# Altium schematic sheet EDU_High-Speed-Design_CPU_DDR3.SchDoc: CPU DDR3
size 431 x 279 mm; Date: not used; ApprovedBy: not used; CheckedBy: not used; Author: not used; DrawnBy: not used; Organization: not used; Address4: not used; SheetNumber: 13; SheetTotal: 26; Time: not used; ImagePath: not used; Application_BuildNumber: not used
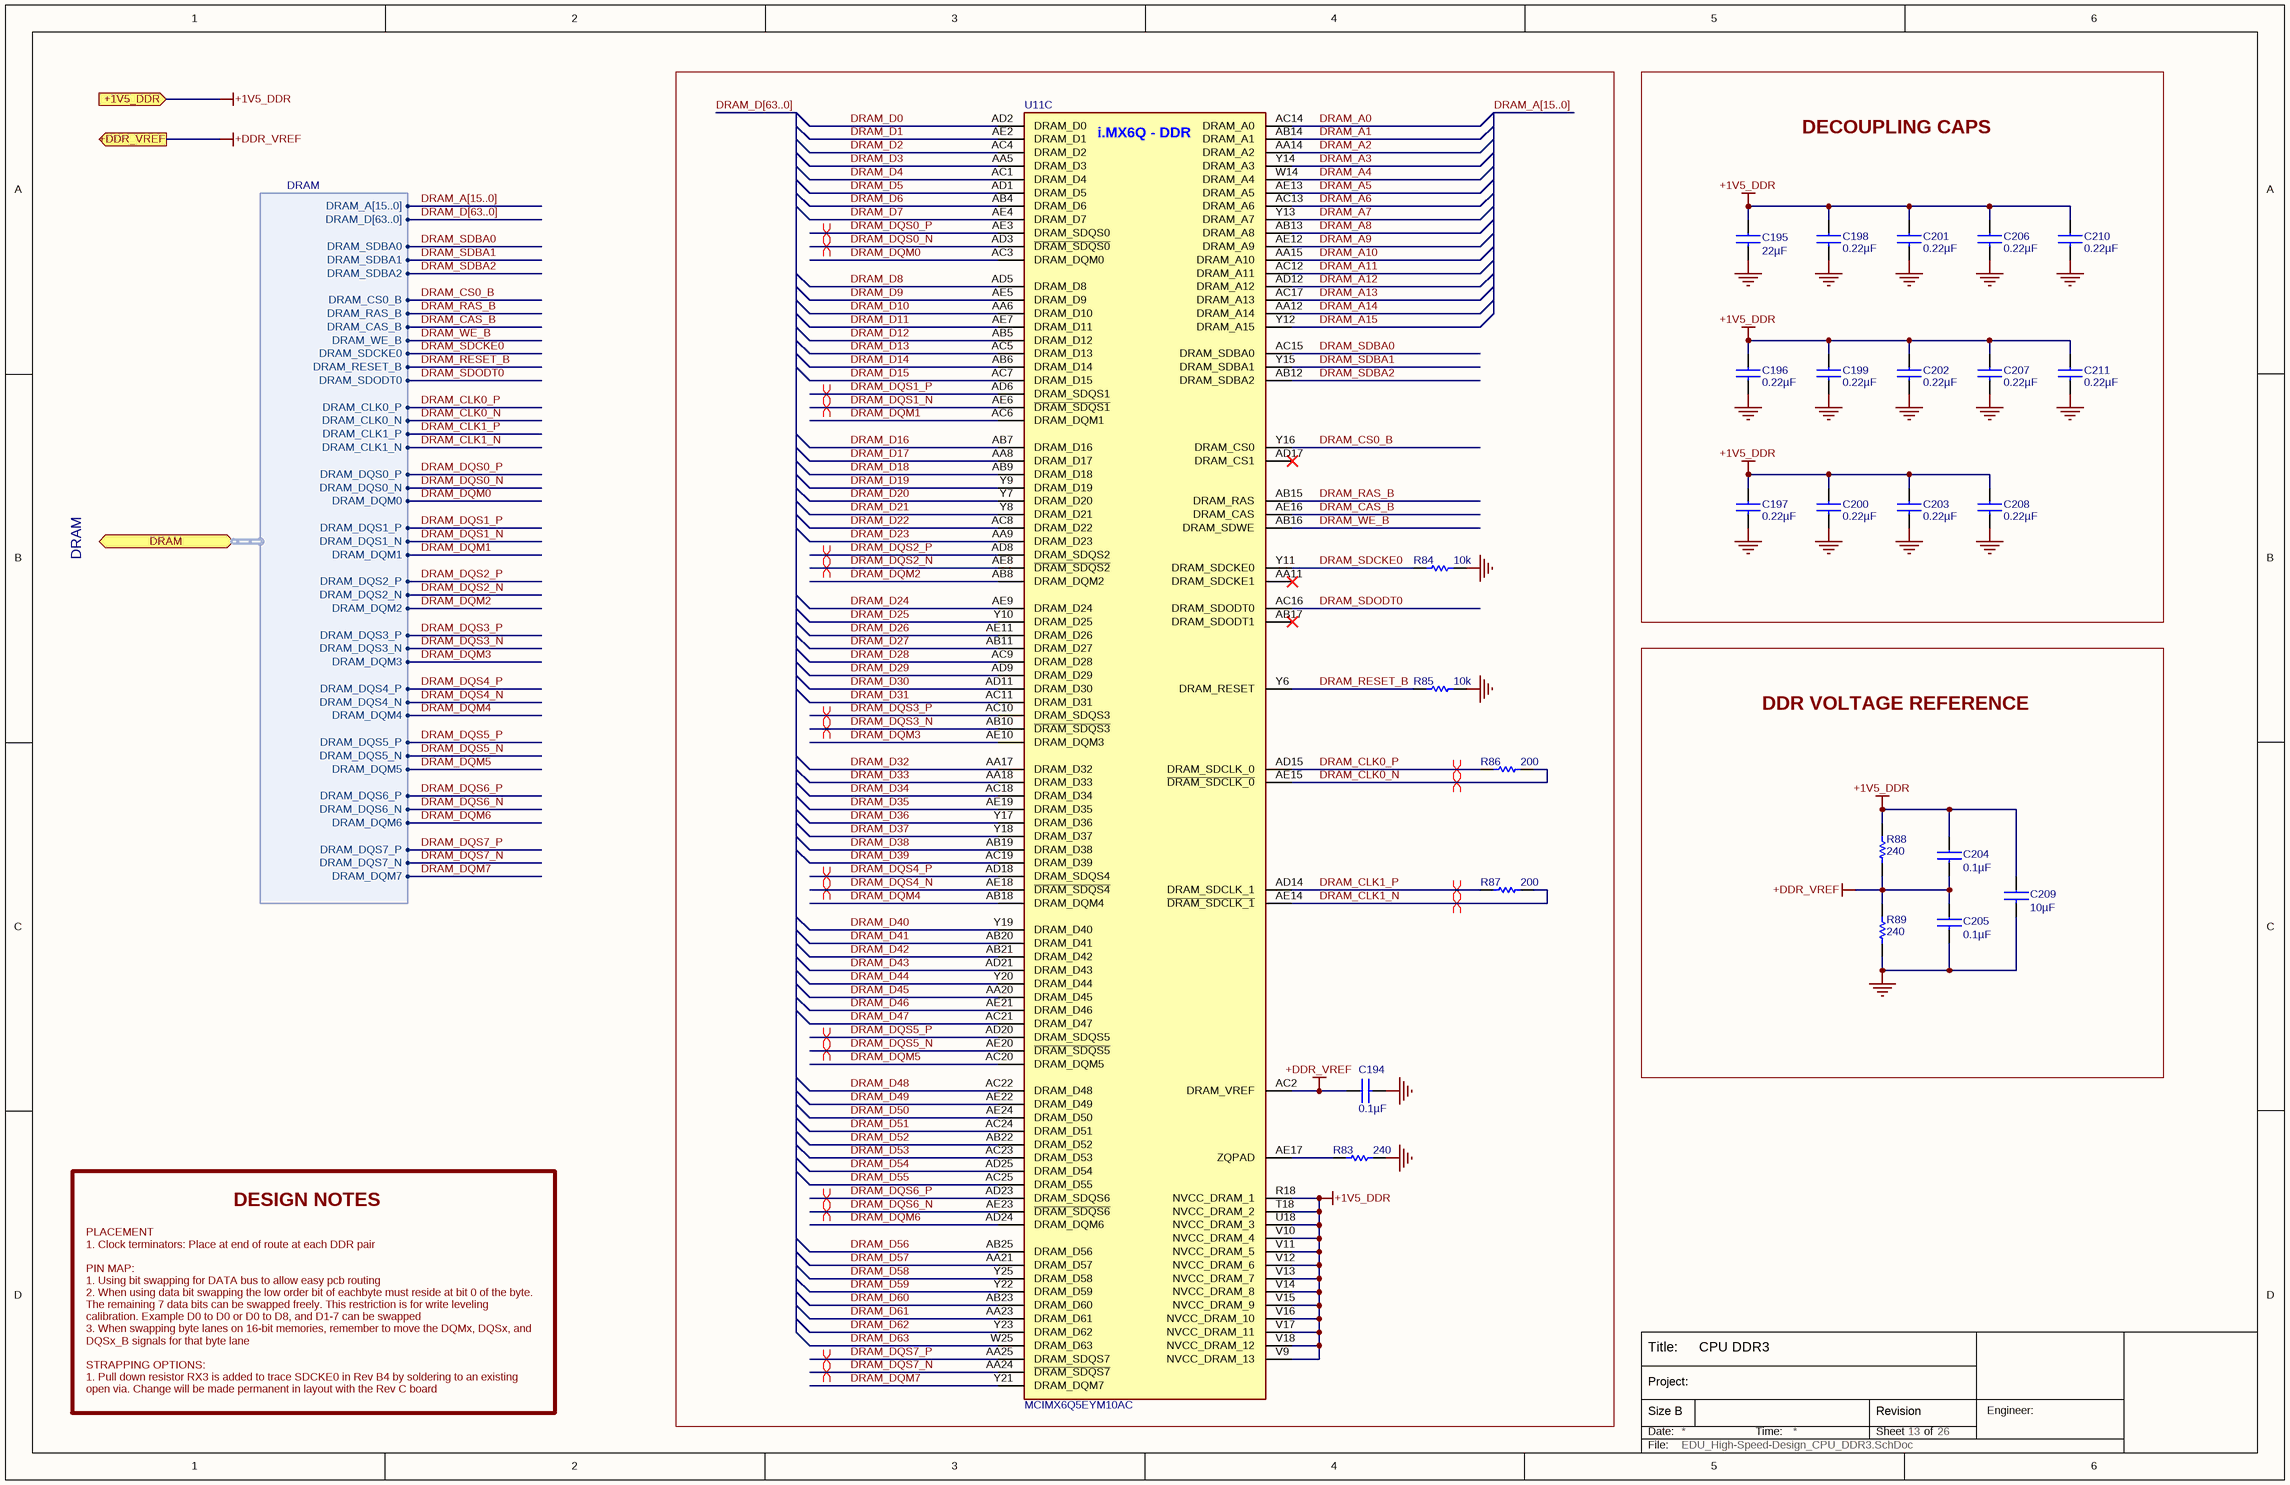
[diagram p0: EDU_High-Speed-Design_CPU_DDR3.SchDoc]

## Parts
C194  0.1µF  [C0402]
C195  22µF  [C0603]
C196  0.22µF  [C0402]
C197  0.22µF  [C0402]
C198  0.22µF  [C0402]
C199  0.22µF  [C0402]
C200  0.22µF  [C0402]
C201  0.22µF  [C0402]
C202  0.22µF  [C0402]
C203  0.22µF  [C0402]
C204  0.1µF  [C0402]
C205  0.1µF  [C0402]
C206  0.22µF  [C0402]
C207  0.22µF  [C0402]
C208  0.22µF  [C0402]
C209  10µF  [C0603]
C210  0.22µF  [C0402]
C211  0.22µF  [C0402]
R83  240  [R0402]
R84  10k  [R0402]
R85  10k  [R0402]
R86  200  [R0402]
R87  200  [R0402]
R88  240  [R0402]
R89  240  [R0402]
U11  MCIMX6Q5EYM10AC  [MCIMX6Q5EYM10AC]  (part C of 15)

## Blocks framed on the sheet
DECOUPLING CAPS: C195-C203 C206-C208 C210 C211
DDR VOLTAGE REFERENCE: C204 C205 C209 R88 R89

## Ports
+1V5_DDR (in), +DDR_VREF (out), DRAM (bidir, harness DRAM)

## Harnesses
DRAM: DRAM_SDCKE0, DRAM_RESET_B, DRAM_CLK0_N, DRAM_CLK1_N, DRAM_CLK1_P, DRAM_SDODT0, DRAM_CS0_B, DRAM_RAS_B, DRAM_CAS_B, DRAM_WE_B, DRAM_A[15..0], DRAM_SDBA0, DRAM_SDBA1, DRAM_SDBA2, DRAM_CLK0_P, DRAM_D[63..0], DRAM_DQS0_P, DRAM_DQS0_N, DRAM_DQM0, DRAM_DQS1_P, DRAM_DQS1_N, DRAM_DQM1, DRAM_DQS2_P, DRAM_DQS2_N, DRAM_DQM2, DRAM_DQS3_P, DRAM_DQS3_N, DRAM_DQM3, DRAM_DQS4_P, DRAM_DQS4_N, DRAM_DQM4, DRAM_DQS5_P, DRAM_DQS5_N, DRAM_DQM5, DRAM_DQS6_P, DRAM_DQS6_N, DRAM_DQM6, DRAM_DQS7_P, DRAM_DQS7_N, DRAM_DQM7

## Nets
+1V5_DDR: C195.1 C196.1 C197.1 C198.1 C199.1 C200.1 C201.1 C202.1 C203.1 C204.1 C206.1 C207.1 C208.1 C209.1 C210.1 C211.1 R88.1 U11.R18(NVCC_DRAM_1) U11.T18(NVCC_DRAM_2) U11.U18(NVCC_DRAM_3) U11.V9(NVCC_DRAM_13) U11.V10(NVCC_DRAM_4) U11.V11(NVCC_DRAM_5) U11.V12(NVCC_DRAM_6) U11.V13(NVCC_DRAM_7) U11.V14(NVCC_DRAM_8) U11.V15(NVCC_DRAM_9) U11.V16(NVCC_DRAM_10) U11.V17(NVCC_DRAM_11) U11.V18(NVCC_DRAM_12) ; port +1V5_DDR
+DDR_VREF: C194.1 C204.2 C205.1 R88.2 R89.1 U11.AC2(DRAM_VREF) ; port +DDR_VREF
GND: C194.2 C195.2 C196.2 C197.2 C198.2 C199.2 C200.2 C201.2 C202.2 C203.2 C205.2 C206.2 C207.2 C208.2 C209.2 C210.2 C211.2 R83.1 R84.2 R85.2 R89.2
DRAM_A0: U11.AC14(DRAM_A0)
DRAM_A1: U11.AB14(DRAM_A1)
DRAM_A2: U11.AA14(DRAM_A2)
DRAM_A3: U11.Y14(DRAM_A3)
DRAM_A4: U11.W14(DRAM_A4)
DRAM_A5: U11.AE13(DRAM_A5)
DRAM_A6: U11.AC13(DRAM_A6)
DRAM_A7: U11.Y13(DRAM_A7)
DRAM_A8: U11.AB13(DRAM_A8)
DRAM_A9: U11.AE12(DRAM_A9)
DRAM_A10: U11.AA15(DRAM_A10)
DRAM_A11: U11.AC12(DRAM_A11)
DRAM_A12: U11.AD12(DRAM_A12)
DRAM_A13: U11.AC17(DRAM_A13)
DRAM_A14: U11.AA12(DRAM_A14)
DRAM_A15: U11.Y12(DRAM_A15)
DRAM_CAS_B: U11.AE16(DRAM_CAS) ; port DRAM.DRAM_CAS_B
DRAM_CLK0_N: R86.2 U11.AE15(~{DRAM_SDCLK_0}) ; port DRAM.DRAM_CLK0_N
DRAM_CLK0_P: R86.1 U11.AD15(DRAM_SDCLK_0) ; port DRAM.DRAM_CLK0_P
DRAM_CLK1_N: R87.2 U11.AE14(~{DRAM_SDCLK_1}) ; port DRAM.DRAM_CLK1_N
DRAM_CLK1_P: R87.1 U11.AD14(DRAM_SDCLK_1) ; port DRAM.DRAM_CLK1_P
DRAM_CS0_B: U11.Y16(DRAM_CS0) ; port DRAM.DRAM_CS0_B
DRAM_D0: U11.AD2(DRAM_D0)
DRAM_D1: U11.AE2(DRAM_D1)
DRAM_D2: U11.AC4(DRAM_D2)
DRAM_D3: U11.AA5(DRAM_D3)
DRAM_D4: U11.AC1(DRAM_D4)
DRAM_D5: U11.AD1(DRAM_D5)
DRAM_D6: U11.AB4(DRAM_D6)
DRAM_D7: U11.AE4(DRAM_D7)
DRAM_D8: U11.AD5(DRAM_D8)
DRAM_D9: U11.AE5(DRAM_D9)
DRAM_D10: U11.AA6(DRAM_D10)
DRAM_D11: U11.AE7(DRAM_D11)
DRAM_D12: U11.AB5(DRAM_D12)
DRAM_D13: U11.AC5(DRAM_D13)
DRAM_D14: U11.AB6(DRAM_D14)
DRAM_D15: U11.AC7(DRAM_D15)
DRAM_D16: U11.AB7(DRAM_D16)
DRAM_D17: U11.AA8(DRAM_D17)
DRAM_D18: U11.AB9(DRAM_D18)
DRAM_D19: U11.Y9(DRAM_D19)
DRAM_D20: U11.Y7(DRAM_D20)
DRAM_D21: U11.Y8(DRAM_D21)
DRAM_D22: U11.AC8(DRAM_D22)
DRAM_D23: U11.AA9(DRAM_D23)
DRAM_D24: U11.AE9(DRAM_D24)
DRAM_D25: U11.Y10(DRAM_D25)
DRAM_D26: U11.AE11(DRAM_D26)
DRAM_D27: U11.AB11(DRAM_D27)
DRAM_D28: U11.AC9(DRAM_D28)
DRAM_D29: U11.AD9(DRAM_D29)
DRAM_D30: U11.AD11(DRAM_D30)
DRAM_D31: U11.AC11(DRAM_D31)
DRAM_D32: U11.AA17(DRAM_D32)
DRAM_D33: U11.AA18(DRAM_D33)
DRAM_D34: U11.AC18(DRAM_D34)
DRAM_D35: U11.AE19(DRAM_D35)
DRAM_D36: U11.Y17(DRAM_D36)
DRAM_D37: U11.Y18(DRAM_D37)
DRAM_D38: U11.AB19(DRAM_D38)
DRAM_D39: U11.AC19(DRAM_D39)
DRAM_D40: U11.Y19(DRAM_D40)
DRAM_D41: U11.AB20(DRAM_D41)
DRAM_D42: U11.AB21(DRAM_D42)
DRAM_D43: U11.AD21(DRAM_D43)
DRAM_D44: U11.Y20(DRAM_D44)
DRAM_D45: U11.AA20(DRAM_D45)
DRAM_D46: U11.AE21(DRAM_D46)
DRAM_D47: U11.AC21(DRAM_D47)
DRAM_D48: U11.AC22(DRAM_D48)
DRAM_D49: U11.AE22(DRAM_D49)
DRAM_D50: U11.AE24(DRAM_D50)
DRAM_D51: U11.AC24(DRAM_D51)
DRAM_D52: U11.AB22(DRAM_D52)
DRAM_D53: U11.AC23(DRAM_D53)
DRAM_D54: U11.AD25(DRAM_D54)
DRAM_D55: U11.AC25(DRAM_D55)
DRAM_D56: U11.AB25(DRAM_D56)
DRAM_D57: U11.AA21(DRAM_D57)
DRAM_D58: U11.Y25(DRAM_D58)
DRAM_D59: U11.Y22(DRAM_D59)
DRAM_D60: U11.AB23(DRAM_D60)
DRAM_D61: U11.AA23(DRAM_D61)
DRAM_D62: U11.Y23(DRAM_D62)
DRAM_D63: U11.W25(DRAM_D63)
DRAM_DQM0: U11.AC3(DRAM_DQM0) ; port DRAM.DRAM_DQM0
DRAM_DQM1: U11.AC6(DRAM_DQM1) ; port DRAM.DRAM_DQM1
DRAM_DQM2: U11.AB8(DRAM_DQM2) ; port DRAM.DRAM_DQM2
DRAM_DQM3: U11.AE10(DRAM_DQM3) ; port DRAM.DRAM_DQM3
DRAM_DQM4: U11.AB18(DRAM_DQM4) ; port DRAM.DRAM_DQM4
DRAM_DQM5: U11.AC20(DRAM_DQM5) ; port DRAM.DRAM_DQM5
DRAM_DQM6: U11.AD24(DRAM_DQM6) ; port DRAM.DRAM_DQM6
DRAM_DQM7: U11.Y21(DRAM_DQM7) ; port DRAM.DRAM_DQM7
DRAM_DQS0_N: U11.AD3(~{DRAM_SDQS0}) ; port DRAM.DRAM_DQS0_N
DRAM_DQS0_P: U11.AE3(DRAM_SDQS0) ; port DRAM.DRAM_DQS0_P
DRAM_DQS1_N: U11.AE6(~{DRAM_SDQS1}) ; port DRAM.DRAM_DQS1_N
DRAM_DQS1_P: U11.AD6(DRAM_SDQS1) ; port DRAM.DRAM_DQS1_P
DRAM_DQS2_N: U11.AE8(~{DRAM_SDQS2}) ; port DRAM.DRAM_DQS2_N
DRAM_DQS2_P: U11.AD8(DRAM_SDQS2) ; port DRAM.DRAM_DQS2_P
DRAM_DQS3_N: U11.AB10(~{DRAM_SDQS3}) ; port DRAM.DRAM_DQS3_N
DRAM_DQS3_P: U11.AC10(DRAM_SDQS3) ; port DRAM.DRAM_DQS3_P
DRAM_DQS4_N: U11.AE18(~{DRAM_SDQS4}) ; port DRAM.DRAM_DQS4_N
DRAM_DQS4_P: U11.AD18(DRAM_SDQS4) ; port DRAM.DRAM_DQS4_P
DRAM_DQS5_N: U11.AE20(~{DRAM_SDQS5}) ; port DRAM.DRAM_DQS5_N
DRAM_DQS5_P: U11.AD20(DRAM_SDQS5) ; port DRAM.DRAM_DQS5_P
DRAM_DQS6_N: U11.AE23(~{DRAM_SDQS6}) ; port DRAM.DRAM_DQS6_N
DRAM_DQS6_P: U11.AD23(DRAM_SDQS6) ; port DRAM.DRAM_DQS6_P
DRAM_DQS7_N: U11.AA24(~{DRAM_SDQS7}) ; port DRAM.DRAM_DQS7_N
DRAM_DQS7_P: U11.AA25(DRAM_SDQS7) ; port DRAM.DRAM_DQS7_P
DRAM_RAS_B: U11.AB15(DRAM_RAS) ; port DRAM.DRAM_RAS_B
DRAM_RESET_B: R85.1 U11.Y6(DRAM_RESET) ; port DRAM.DRAM_RESET_B
DRAM_SDBA0: U11.AC15(DRAM_SDBA0) ; port DRAM.DRAM_SDBA0
DRAM_SDBA1: U11.Y15(DRAM_SDBA1) ; port DRAM.DRAM_SDBA1
DRAM_SDBA2: U11.AB12(DRAM_SDBA2) ; port DRAM.DRAM_SDBA2
DRAM_SDCKE0: R84.1 U11.Y11(DRAM_SDCKE0) ; port DRAM.DRAM_SDCKE0
DRAM_SDODT0: U11.AC16(DRAM_SDODT0) ; port DRAM.DRAM_SDODT0
DRAM_WE_B: U11.AB16(DRAM_SDWE) ; port DRAM.DRAM_WE_B
NetR83_2: R83.2 U11.AE17(ZQPAD)

Not connected (* = marked no-connect by the designer): U11 AA11(DRAM_SDCKE1)* AB17(DRAM_SDODT1)* AD17(DRAM_CS1)*

## Buses and harness runs
bus DRAM_A[15..0]
bus DRAM_D[63..0]

## Layout directives
differential pair: DRAM_CLK0_N, DRAM_CLK0_P, DRAM_CLK1_N, DRAM_CLK1_P, DRAM_DQS0_N, DRAM_DQS0_P, DRAM_DQS1_N, DRAM_DQS1_P, DRAM_DQS2_N, DRAM_DQS2_P, DRAM_DQS3_N, DRAM_DQS3_P, DRAM_DQS4_N, DRAM_DQS4_P, DRAM_DQS5_N, DRAM_DQS5_P, DRAM_DQS6_N, DRAM_DQS6_P, DRAM_DQS7_N, DRAM_DQS7_P

## Notes on the sheet
- DRAM
- DESIGN NOTES
- PLACEMENT
  1. Clock terminators: Place at end of route at each DDR pair
  PIN MAP:
  1. Using bit swapping for DATA bus to allow easy pcb routing
  2. When using data bit swapping the low order bit of eachbyte must reside at bit 0 of the byte. The remaining 7 data bits can be swapped freely. This restriction is for write leveling calibration. Example D0 to D0 or D0 to D8, and D1-7 can be swapped
  3. When swapping byte lanes on 16-bit memories, remember to move the DQMx, DQSx, and DQSx_B signals for that byte lane
  STRAPPING OPTIONS:
  1. Pull down resistor RX3 is added to trace SDCKE0 in Rev B4 by soldering to an existing open via. Change will be made permanent in layout with the Rev C board
- Title:
- Date:
- Size B
- Project:
- Time:
- Sheet
- Revision
- of
- Engineer:
- File:
- (in symbol MCIMX6Q5EYM10AC, part C) i.MX6Q - DDR

## Library data of the parts
C194 C204 C205 = C1005X5R1H104K: CAP CER .10UF 50V X5R 10% 0402; Manufacturer 1: TDK Corporation; Capacitance: 0.1µF; Manufacturer Part Number 1: C1005X5R1H104K; Voltage: 50V; Supplier 1: Digi-Key; Supplier Part Number 1: 445-5942-1-ND; ComponentLink1URL: http://www.tdk.co.jp/tefe02/e412_c.pdf; ComponentLink1Description: http://www.tdk.co.jp/tefe02/e412_c.pdf
C195 = GRM188R60G226MEA0L: CAP CER 22UF 4V 20% X5R 0603; Manufacturer 1: Murata Electronics North America; Supplier 1: Digi-Key; Supplier Part Number 1: 490-5526-1-ND; Manufacturer Part Number 1: GRM188R60G226MEA0L; Capacitance: 22µF; Voltage: 4V; ComponentLink1URL: http://www.murata.com/products/catalog/pdf/c02e.pdf; ComponentLink1Description: http://www.murata.com/products/catalog/pdf/c02e.pdf
C196-C203 C206-C208 C210 C211 = C1005X5R1E224M: CAP CER .22UF 25V X5R 20% 0402; Manufacturer 1: TDK Corporation; Capacitance: 0.22µF; Manufacturer Part Number 1: C1005X5R1E224M; Voltage: 25V; Supplier 1: Digi-Key; Supplier Part Number 1: 445-5945-1-ND; ComponentLink1URL: http://www.tdk.co.jp/tefe02/e412_c.pdf; ComponentLink1Description: http://www.tdk.co.jp/tefe02/e412_c.pdf
C209 = C1608X5R0J106M: CAP CER 10UF 6.3V X5R 20% 0603; Manufacturer 1: TDK Corporation; Capacitance: 10µF; Manufacturer Part Number 1: C1608X5R0J106M; Voltage: 6.3V; Supplier 1: Digi-Key; Supplier Part Number 1: 445-4112-1-ND; ComponentLink1URL: http://www.tdk.com/pdf/general_B11.pdf; ComponentLink1Description: http://www.tdk.com/pdf/general_B11.pdf
R83 R88 R89 = RMCF0402FT240R: RES TF 240 OHM 1% 0.0625W 0402; Manufacturer 1: Stackpole Electronics Inc; Manufacturer Part Number 1: RMCF0402FT240R; Resistance: 240; Supplier 1: Digi-Key; Supplier Part Number 1: RMCF0402FT240RCT-ND; ComponentLink1URL: http://www.seielect.com/Catalog/SEI-RMCF.pdf; ComponentLink1Description: http://www.seielect.com/Catalog/SEI-RMCF.pdf
R84 R85 = RC0402FR-0710KL: RES 10.0K OHM 1/16W 1% 0402 SMD; Manufacturer 1: Yageo; Manufacturer Part Number 1: RC0402FR-0710KL; Resistance: 10k; Supplier 1: Digi-Key; Supplier Part Number 1: 311-10.0KLRCT-ND; ComponentLink1URL: http://www.yageo.com/documents/recent/PYu-RC0402_51_RoHS_L_6.pdf; ComponentLink1Description: http://www.yageo.com/documents/recent/PYu-RC0402_51_RoHS_L_6.pdf
R86 R87 = CRCW0402200RFKED: RES 200 OHM 1/16W 1% 0402 SMD; Manufacturer 1: Vishay Dale; Supplier 1: Digi-Key; Manufacturer Part Number 1: CRCW0402200RFKED; Resistance: 200; ComponentLink1URL: http://www.vishay.com/doc?20035; ComponentLink1Description: http://www.vishay.com/doc?20035; Supplier Part Number 1: 541-200LCT-ND
U11 = MCIMX6Q5EYM10AC: IC MCU 32BIT ARM QUAD 624FCBGA; Manufacturer 1: Freescale Semiconductor; Supplier 1: Digi-Key; Manufacturer Part Number 1: MCIMX6Q5EYM10AC; Supplier Part Number 1: MCIMX6Q5EYM10AC-ND